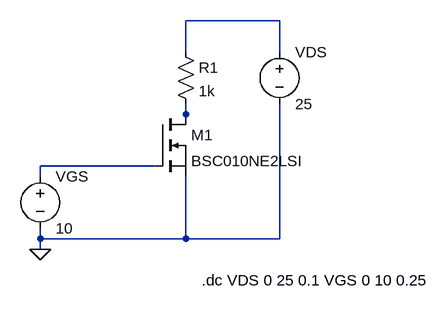
[diagram p0: schematic model2.asc]
model2.asc, the LTspice schematic file:
Version 4
SHEET 1 880 680
WIRE 368 -16 224 -16
WIRE 224 32 224 -16
WIRE 368 32 368 -16
WIRE 224 128 224 112
WIRE 224 144 224 128
WIRE 176 208 0 208
WIRE 0 224 0 208
WIRE 0 320 0 304
WIRE 224 320 224 224
WIRE 224 320 0 320
WIRE 368 320 368 112
WIRE 368 320 224 320
WIRE 0 336 0 320
FLAG 0 336 0
SYMBOL nmos 176 128 R0
SYMATTR InstName M1
SYMATTR Value BSC010NE2LSI
SYMBOL voltage 368 16 R0
WINDOW 123 0 0 Left 0
WINDOW 39 0 0 Left 0
SYMATTR InstName VDS
SYMATTR Value 25
SYMBOL res 208 16 R0
SYMATTR InstName R1
SYMATTR Value 1k
SYMBOL voltage 0 208 R0
WINDOW 123 0 0 Left 0
WINDOW 39 0 0 Left 0
SYMATTR InstName VGS
SYMATTR Value 10
TEXT 248 384 Left 2 !.dc VDS 0 25 0.1 VGS 0 10 0.25

The netlist it stands for:
* model2.asc
M1 N002 N003 0 0 BSC010NE2LSI
VDS N001 0 25
R1 N001 N002 1k
VGS N003 0 10
.model NMOS NMOS
.model PMOS PMOS
.lib standard.mos
.dc VDS 0 25 0.1 VGS 0 10 0.25
.backanno
.end